# Altium schematic sheet Outgoing_Connector_8.SchDoc
size A4
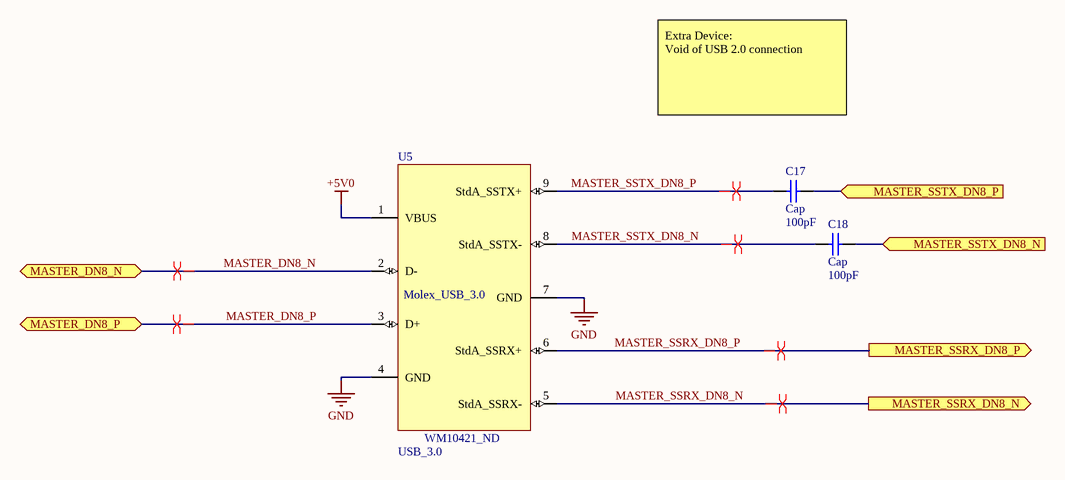
[diagram p0: Outgoing_Connector_8.SchDoc]

## Parts
C17  Cap  value 100pF  [RAD-0.3]
C18  Cap  value 100pF  [RAD-0.3]
U5  USB_3.0  [Molex_USB_3.0_WM10421_ND]

## Ports
MASTER_DN8_N (bidir), MASTER_DN8_P (bidir), MASTER_SSRX_DN8_N (out), MASTER_SSRX_DN8_P (out), MASTER_SSTX_DN8_N (in), MASTER_SSTX_DN8_P (in)

## Nets
+5V0: U5.1(VBUS)
GND: U5.4(GND) U5.7(GND)
 MASTER_DN8_N: U5.2(D-) ; port MASTER_DN8_N
 MASTER_DN8_P: U5.3(D+) ; port MASTER_DN8_P
MASTER_SSRX_DN8_N: U5.5(StdA_SSRX-) ; port MASTER_SSRX_DN8_N
MASTER_SSRX_DN8_P: U5.6(StdA_SSRX+) ; port MASTER_SSRX_DN8_P
MASTER_SSTX_DN8_N: C18.1 U5.8(StdA_SSTX-)
MASTER_SSTX_DN8_N: C18.2 ; port MASTER_SSTX_DN8_N  [a separate net that carries the same name]
MASTER_SSTX_DN8_P: C17.1 U5.9(StdA_SSTX+)
MASTER_SSTX_DN8_P: C17.2 ; port MASTER_SSTX_DN8_P  [a separate net that carries the same name]

## Layout directives
differential pair:  MASTER_DN8_N,  MASTER_DN8_P, MASTER_SSRX_DN8_N, MASTER_SSRX_DN8_P, MASTER_SSTX_DN8_N, MASTER_SSTX_DN8_P

## Notes on the sheet
- Extra Device:
  Void of USB 2.0 connection
- (in symbol Molex_USB_3.0_WM10421_ND) Molex_USB_3.0; WM10421_ND

## Library data of the parts
C17 C18 = Cap: Capacitor; Published: 8-Jun-2000; LatestRevisionDate: 17-Jul-2002; LatestRevisionNote: Re-released for DXP Platform.; PackageReference: RAD-0.3; Publisher: Altium Limited; PackageDescription: Radial Cap, Thru-Hole; 2 Leads; 0.3 in Pin Spacing
U5 = Molex_USB_3.0_WM10421_ND: USB 3.0 Type A Receptacle Connector 9 Position Through Hole; Manufacturer: Molex; Manufacturer Profuct #: 0484080003; Price (CAD): 1.98; ComponentLink1Description: Datasheet; ComponentLink1URL: media.digikey.com/pdf/Data%20Sheets/Molex%20PDFs/48408-001_Pkg%20Spec.pdf; ComponentLink2Description: Datasheet_Model; ComponentLink2URL: molex.com/pdm_docs/sd/484080003_sd.pdf